# Altium project hw-SerreAutomatisee.PrjPcb
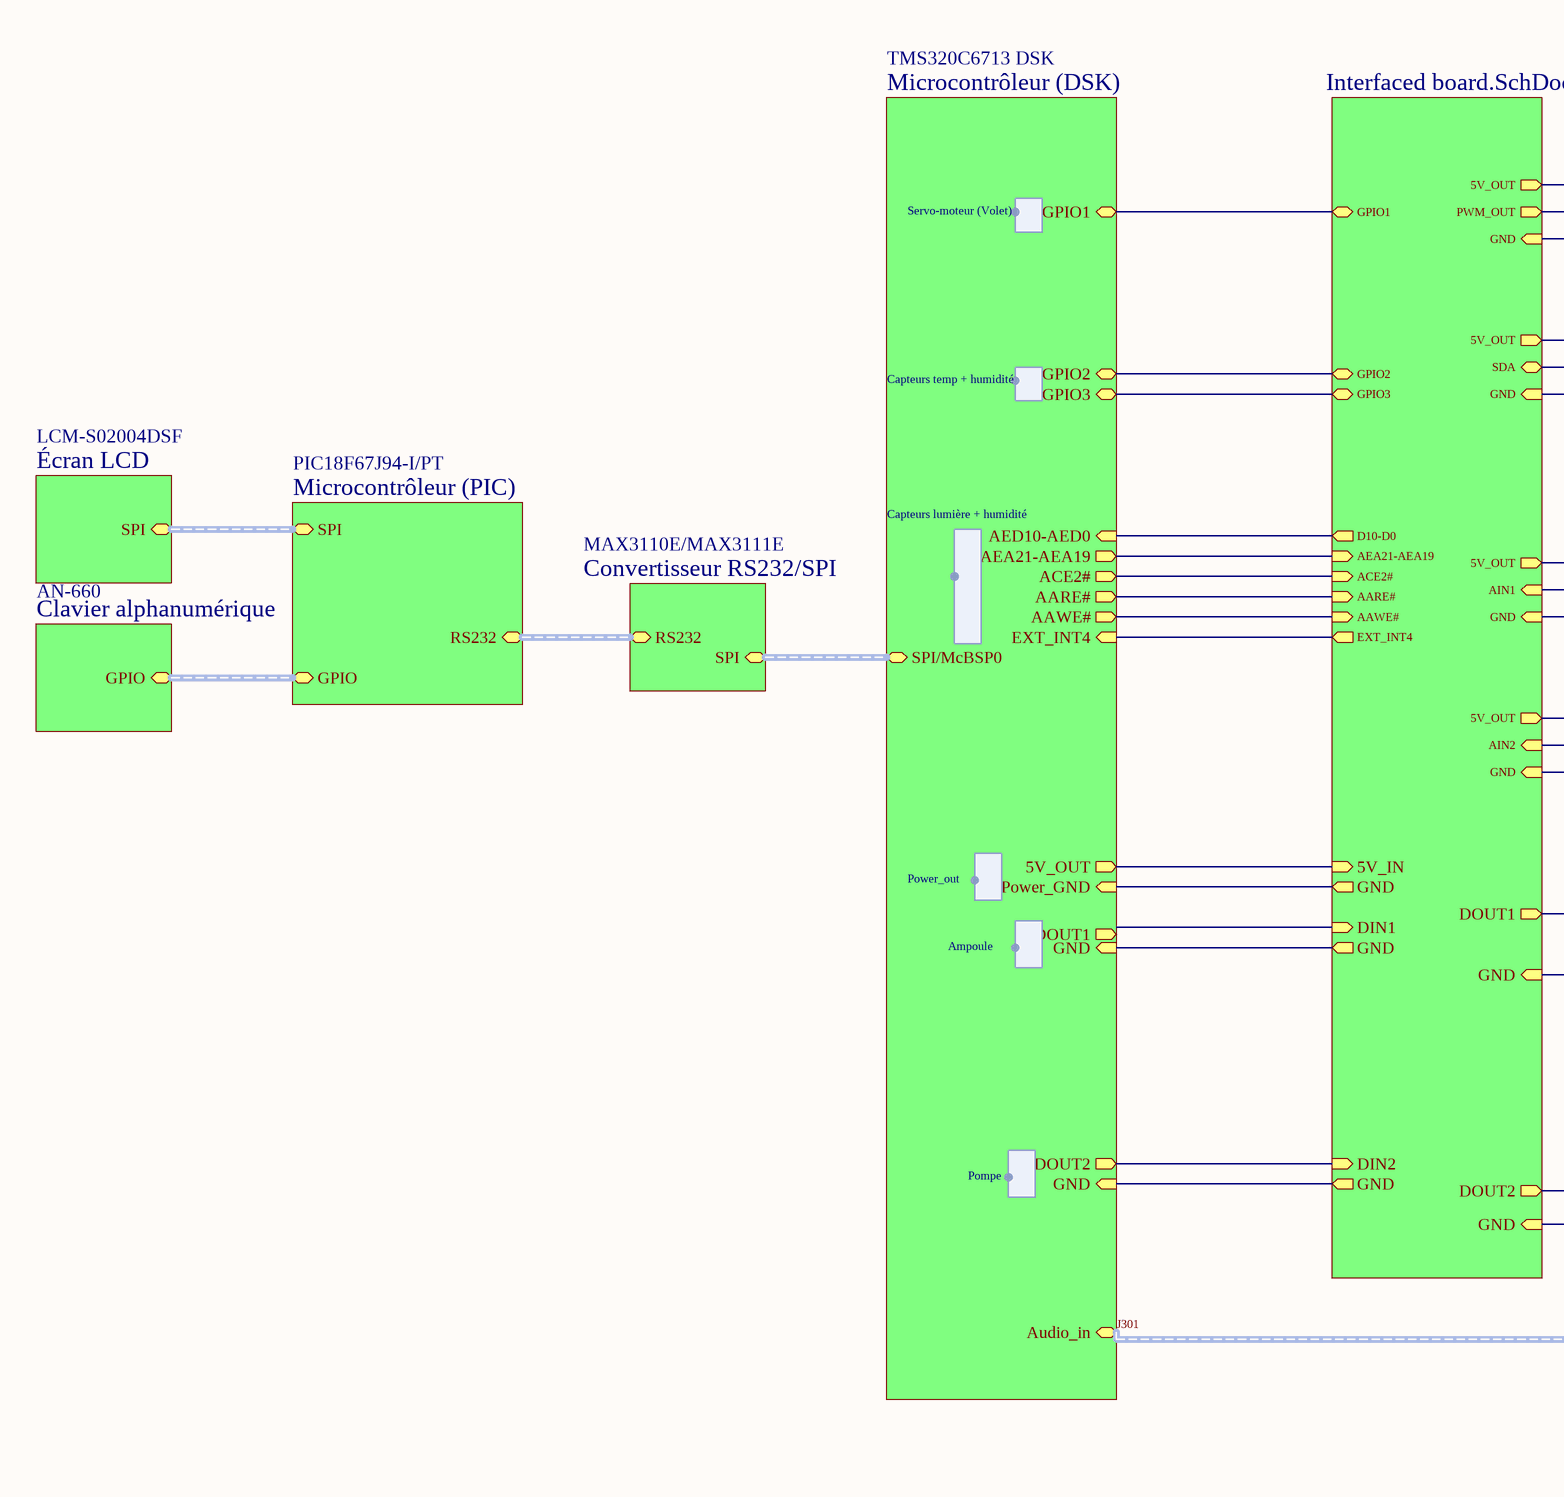
[diagram p0: Plan sommaire.SchDoc, left]
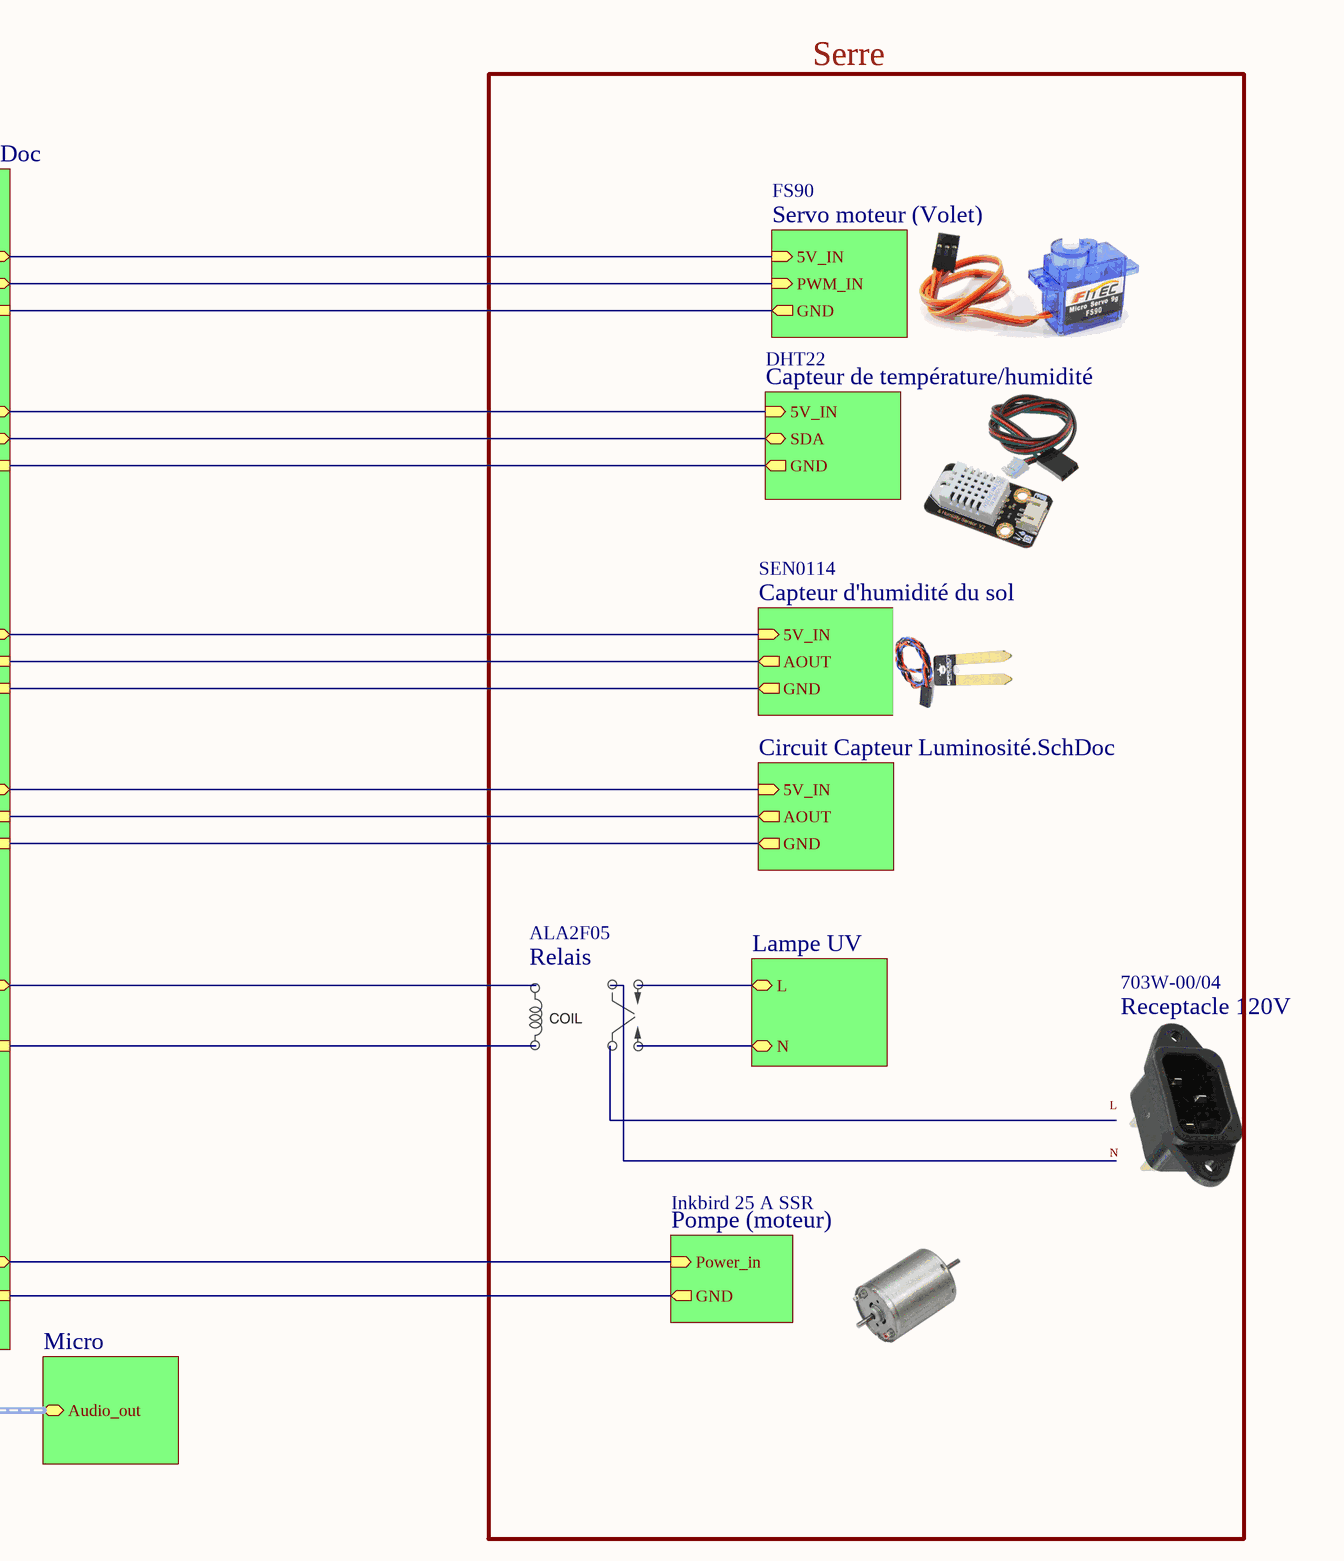
[diagram p1: Plan sommaire.SchDoc, right]
3 sheets, 10 parts. Net scope: hierarchical (ports join the sheet entries above them; power ports are global).
Sheets:
  Plan sommaire.SchDoc
     = Circuit Capteur Luminosité.SchDoc
     = Interfaced board.SchDoc

## Sheet Plan sommaire.SchDoc
size 635 x 457 mm

### Sub-sheets
AN-660 = Clavier alphanumérique (file not in this document): GPIO
DHT22 = Capteur de température/humidité (file not in this document): 5V_IN (in), SDA (bidir), GND (out)
FS90 = Servo moteur (Volet) (file not in this document): PWM_IN (in), 5V_IN (in), GND (out)
Inkbird 25 A SSR = Pompe (moteur) (file not in this document): Power_in (in), GND (out)
LCM-S02004DSF = Écran LCD (file not in this document): SPI
MAX3110E/MAX3111E = Convertisseur RS232/SPI (file not in this document): RS232, SPI
PIC18F67J94-I/PT = Microcontrôleur (PIC) (file not in this document): SPI, GPIO, RS232
SEN0114 = Capteur d'humidité du sol (file not in this document): AOUT (out), 5V_IN (in), GND (out)
TMS320C6713 DSK = Microcontrôleur (DSK) (file not in this document): SPI/McBSP0, GPIO1, 5V_OUT (out), DOUT2 (out), Audio_in, GND (in), Power_GND (in), DOUT1 (out), GND (in), AEA21-AEA19 (out), AED10-AED0 (in), ACE2# (out), AARE# (out), AAWE# (out), EXT_INT4 (in), GPIO2, GPIO3
? = Micro (file not in this document): Audio_out
? = Lampe UV (file not in this document): L, N
? = Circuit Capteur Luminosité.SchDoc: AOUT (out), 5V_IN (in), GND (out)
? = Interfaced board.SchDoc: DIN2 (in), GND (out), DIN1 (in), GND (out), DOUT1 (out), GND (in), DOUT2 (out), GND (in), GND (out), 5V_IN (in), 5V_OUT (out), AIN1 (in), GND (in), 5V_OUT (out), AIN2 (in), GND (in), D10-D0 (out), AEA21-AEA19 (in), ACE2# (in), AARE# (in), AAWE# (in), EXT_INT4 (out), 5V_OUT (out), PWM_OUT (out), GND (in), 5V_OUT (out), SDA (bidir), GND (in), GPIO1, GPIO2, GPIO3

### Harnesses
Power_out: 
Ampoule: 
Pompe: 
Capteurs lumière + humidité: 
Capteurs temp + humidité: 
Servo-moteur (Volet): 

### Nets
16: sheet TMS320C6713 DSK/5V_OUT, sheet TMS320C6713 DSK/GND, sheet TMS320C6713 DSK/Power_GND, sheet TMS320C6713 DSK/GND, sheet DHT22/5V_IN, sheet DHT22/GND, sheet SEN0114/5V_IN, sheet SEN0114/GND, sheet /5V_IN, sheet /GND, sheet FS90/5V_IN, sheet FS90/GND, sheet Inkbird 25 A SSR/GND, sheet /GND, sheet /GND, sheet /GND, sheet /GND, sheet /GND, sheet /5V_IN, sheet /5V_OUT, sheet /GND, sheet /5V_OUT, sheet /GND, sheet /5V_OUT, sheet /GND, sheet /5V_OUT, sheet /GND
4: sheet SEN0114/AOUT, sheet /AOUT, sheet /AIN1, sheet /AIN2
10: sheet TMS320C6713 DSK/EXT_INT4, sheet /EXT_INT4
23: sheet TMS320C6713 DSK/AAWE#, sheet /AAWE#
24: sheet TMS320C6713 DSK/AARE#, sheet /AARE#
NetD?#2_2: sheet Inkbird 25 A SSR/Power_in, sheet /DOUT2
NetR?#5_1: sheet TMS320C6713 DSK/DOUT2, sheet /DIN2
(unnamed): sheet TMS320C6713 DSK/GPIO1, sheet FS90/PWM_IN, sheet /PWM_OUT, sheet /GPIO1
(unnamed): sheet TMS320C6713 DSK/AEA21-AEA19, sheet /AEA21-AEA19
(unnamed): sheet TMS320C6713 DSK/AED10-AED0, sheet /D10-D0
(unnamed): sheet TMS320C6713 DSK/ACE2#, sheet /ACE2#
(unnamed): sheet TMS320C6713 DSK/GPIO2, sheet TMS320C6713 DSK/GPIO3, sheet DHT22/SDA, sheet /SDA, sheet /GPIO2, sheet /GPIO3

### Buses and harness runs
harness J301 = sheet /Audio_out = sheet TMS320C6713 DSK/Audio_in
harness sheet AN-660/GPIO = sheet PIC18F67J94-I/PT/GPIO
harness sheet LCM-S02004DSF/SPI = sheet PIC18F67J94-I/PT/SPI
harness sheet MAX3110E/MAX3111E/RS232 = sheet PIC18F67J94-I/PT/RS232
harness sheet MAX3110E/MAX3111E/SPI = sheet TMS320C6713 DSK/SPI/McBSP0

### Notes on the sheet
- Serre
- Relais
- ALA2F05
- Receptacle 120V
- 703W-00/04
- Labels drawn without touching a wire or pin: L

## Sheet Circuit Capteur Luminosité.SchDoc
size 127 x 101 mm
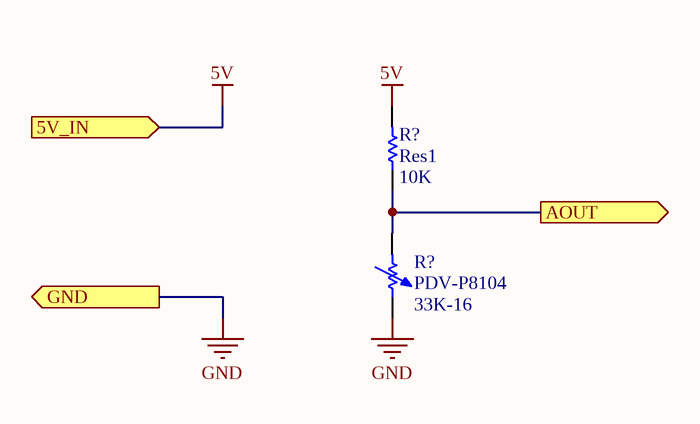
[diagram p2: Circuit Capteur Luminosité.SchDoc]

### Parts
(Parts that share a designator on the sheet are numbered #1, #2 ... from top to bottom, then left to right.)
R?#1  Res1  value 10K  [AXIAL-0.3]
R?#2  PDV-P8104  value 33K-16  [AXIAL-0.7]

### Ports
5V_IN (in), AOUT (out), GND (out)

### Nets
5V: R?#1.2 R?#2.2 ; port 5V_IN, port GND  [also labelled GND]  [project net 16]
4: R?#1.1 R?#2.1 ; port AOUT

### Library data of the parts
R?#1 = Res1: Resistor; Published: 8-Jun-2000; LatestRevisionDate: 17-Jul-2002; LatestRevisionNote: Re-released for DXP Platform.; PackageReference: AXIAL-0.3; Publisher: Altium Limited; PackageDescription: Axial Device, Thru-Hole; 2 Leads; 0.3 in Pin Spacing
R?#2 = Res Adj1: Variable Resistor; Set Position: 0.5; Published: 8-Jun-2000; LatestRevisionDate: 17-Jul-2002; LatestRevisionNote: Re-released for DXP Platform.; PackageReference: AXIAL-0.7; Publisher: Altium Limited; PackageDescription: Axial Device, Thru-Hole; 2 Leads; 0.7 in Pin Spacing

## Sheet Interfaced board.SchDoc
size 508 x 381 mm
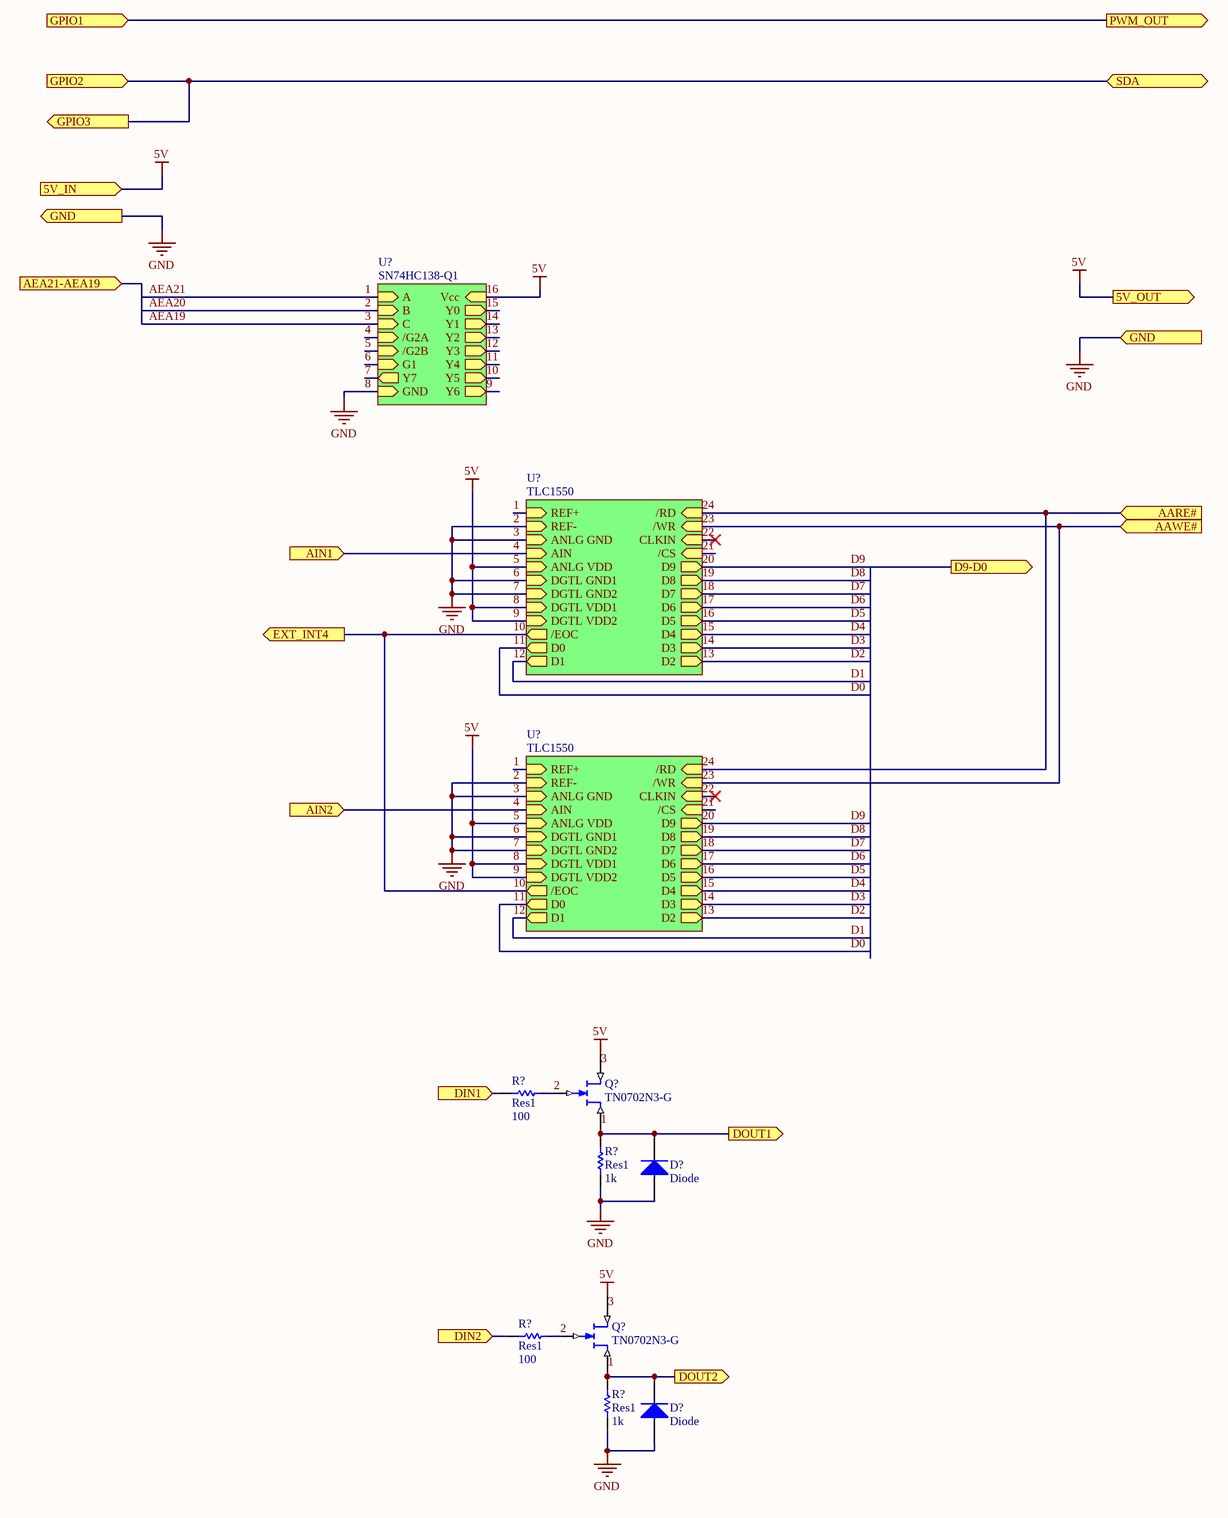
[diagram p3: Interfaced board.SchDoc]

### Parts
(Parts that share a designator on the sheet are numbered #1, #2 ... from top to bottom, then left to right.)
D?#1  Diode  [SMC]
D?#2  Diode  [SMC]
Q?#1  TN0702N3-G  [TO-18]
Q?#2  TN0702N3-G  [TO-18]
R?#3  Res1  value 100  [AXIAL-0.3]
R?#4  Res1  value 1k  [AXIAL-0.3]
R?#5  Res1  value 100  [AXIAL-0.3]
R?#6  Res1  value 1k  [AXIAL-0.3]

### Sub-sheets
SN74HC138-Q1 = File Name (file not in this document): A (in), B (in), Vcc (in), C (in), /G2A (in), /G2B (in), G1 (in), Y7 (out), GND (in), Y0 (out), Y1 (out), Y2 (out), Y3 (out), Y4 (out), Y5 (out), Y6 (out)  | Designator: U?
TLC1550 = ?: REF+ (in), REF- (in), /RD (in), ANLG GND (in), AIN (in), ANLG VDD (in), DGTL GND1 (in), DGTL GND2 (in), DGTL VDD1 (in), DGTL VDD2 (in), /EOC (out), D0 (out), D1 (out), /WR (in), CLKIN (in), /CS (in), D9 (out), D8 (out), D7 (out), D6 (out), D5 (out), D4 (out), D3 (out), D2 (out)  | Designator: U?
TLC1550 = ?: REF+ (in), REF- (in), /RD (in), ANLG GND (in), AIN (in), ANLG VDD (in), DGTL GND1 (in), DGTL GND2 (in), DGTL VDD1 (in), DGTL VDD2 (in), /EOC (out), D0 (out), D1 (out), /WR (in), CLKIN (in), /CS (in), D9 (out), D8 (out), D7 (out), D6 (out), D5 (out), D4 (out), D3 (out), D2 (out)  | Designator: U?

### Ports
5V_IN (in), 5V_OUT (out), AARE# (in), AAWE# (in), AEA21-AEA19 (in), AIN1 (in), AIN2 (in), D9-D0 (out), DIN1 (in), DIN2 (in), DOUT1 (out), DOUT2 (out), EXT_INT4 (out), GND (in), GND (out), GPIO1 (in), GPIO2 (in), GPIO3 (out), PWM_OUT (out), SDA (bidir)

### Nets
16: D?#1.1(A) D?#2.1(A) Q?#1.1(D) Q?#1.2(G) Q?#2.1(D) Q?#2.2(G) R?#3.2 R?#4.1 R?#5.2 R?#6.1 ; port 5V_IN, port GND, port 5V_OUT, sheet SN74HC138-Q1/B, sheet SN74HC138-Q1/Vcc, sheet SN74HC138-Q1/C, sheet SN74HC138-Q1//G2B, sheet SN74HC138-Q1/G1, sheet SN74HC138-Q1/Y7, sheet SN74HC138-Q1/GND, sheet SN74HC138-Q1/Y6, sheet TLC1550/REF-, sheet TLC1550/ANLG GND, sheet TLC1550/ANLG VDD, sheet TLC1550/DGTL GND1, sheet TLC1550/DGTL GND2, sheet TLC1550/DGTL VDD1, sheet TLC1550/DGTL VDD2, sheet TLC1550/D5, sheet TLC1550/REF-, sheet TLC1550/ANLG GND, sheet TLC1550/ANLG VDD, sheet TLC1550/DGTL GND1, sheet TLC1550/DGTL GND2, sheet TLC1550/DGTL VDD1, sheet TLC1550/DGTL VDD2, sheet TLC1550/D5  [also labelled 2, 3, 5, 5V, 6, 7, 8, 9, AEA19, AEA20, D5, GND]
1: sheet SN74HC138-Q1/A, sheet TLC1550/REF+, sheet TLC1550/REF+  [also labelled AEA21]
4: port AIN1, port AIN2, sheet SN74HC138-Q1//G2A, sheet TLC1550/AIN, sheet TLC1550/AIN
10: port EXT_INT4, sheet SN74HC138-Q1/Y5, sheet TLC1550//EOC, sheet TLC1550//EOC
11: sheet SN74HC138-Q1/Y4, sheet TLC1550/D0, sheet TLC1550/D0  [also labelled D0]
12: sheet SN74HC138-Q1/Y3, sheet TLC1550/D1, sheet TLC1550/D1  [also labelled D1]
13: sheet SN74HC138-Q1/Y2, sheet TLC1550/D2, sheet TLC1550/D2  [also labelled D2]
14: sheet SN74HC138-Q1/Y1, sheet TLC1550/D3, sheet TLC1550/D3  [also labelled D3]
15: sheet SN74HC138-Q1/Y0, sheet TLC1550/D4, sheet TLC1550/D4  [also labelled D4]
17: sheet TLC1550/D6, sheet TLC1550/D6  [also labelled D6]
18: sheet TLC1550/D7, sheet TLC1550/D7  [also labelled D7]
19: sheet TLC1550/D8, sheet TLC1550/D8  [also labelled D8]
20: sheet TLC1550/D9, sheet TLC1550/D9  [also labelled D9]
21: sheet TLC1550//CS, sheet TLC1550//CS
22: sheet TLC1550/CLKIN, sheet TLC1550/CLKIN
23: port AAWE#, sheet TLC1550//WR, sheet TLC1550//WR
24: port AARE#, sheet TLC1550//RD, sheet TLC1550//RD
NetD?#1_2: D?#1.2(K) Q?#1.3(S) R?#4.2 ; port DOUT1
NetD?#2_2: D?#2.2(K) Q?#2.3(S) R?#6.2 ; port DOUT2
NetR?#3_1: R?#3.1 ; port DIN1
NetR?#5_1: R?#5.1 ; port DIN2
(unnamed): port GPIO1, port PWM_OUT
(unnamed): port GPIO2, port SDA, port GPIO3

### Notes on the sheet
- Labels drawn without touching a wire or pin: 1, 3

### Library data of the parts
D?#1 D?#2 = Diode: Default Diode; Published: 8-Jun-2000; LatestRevisionDate: 17-Jul-2002; LatestRevisionNote: Re-released for DXP Platform.; PackageVersion: Sep-1996; PackageReference: SMC; Publisher: Altium Limited; PackageDescription: DO-214-AB/SMC; 2 C-Bend Leads; Body 7.9 x 5.9 mm, inc. leads (LxW); Code_JEDEC: DO-214-AB
Q?#1 Q?#2 = MESFET-N: N-Channel MESFET; Published: 8-Jun-2000; LatestRevisionDate: 17-Jul-2002; LatestRevisionNote: Re-released for DXP Platform.; PackageReference: TO-18; Publisher: Altium Limited; PackageDescription: Can; 3 Leads; Pin Circle Dia. 2.54 mm; Lead Dia. 0.48 mm (max); Code_JEDEC: TO-18
R?#3-R?#6 = Res1: Resistor; Published: 8-Jun-2000; LatestRevisionDate: 17-Jul-2002; LatestRevisionNote: Re-released for DXP Platform.; PackageReference: AXIAL-0.3; Publisher: Altium Limited; PackageDescription: Axial Device, Thru-Hole; 2 Leads; 0.3 in Pin Spacing

## Nets that join several sheets
16: Circuit Capteur Luminosité (R?#1.2 R?#2.2), Interfaced board (10 pins)